# EAGLE schematic Brakeout board - wire connection (EAGLE 9.6.2)
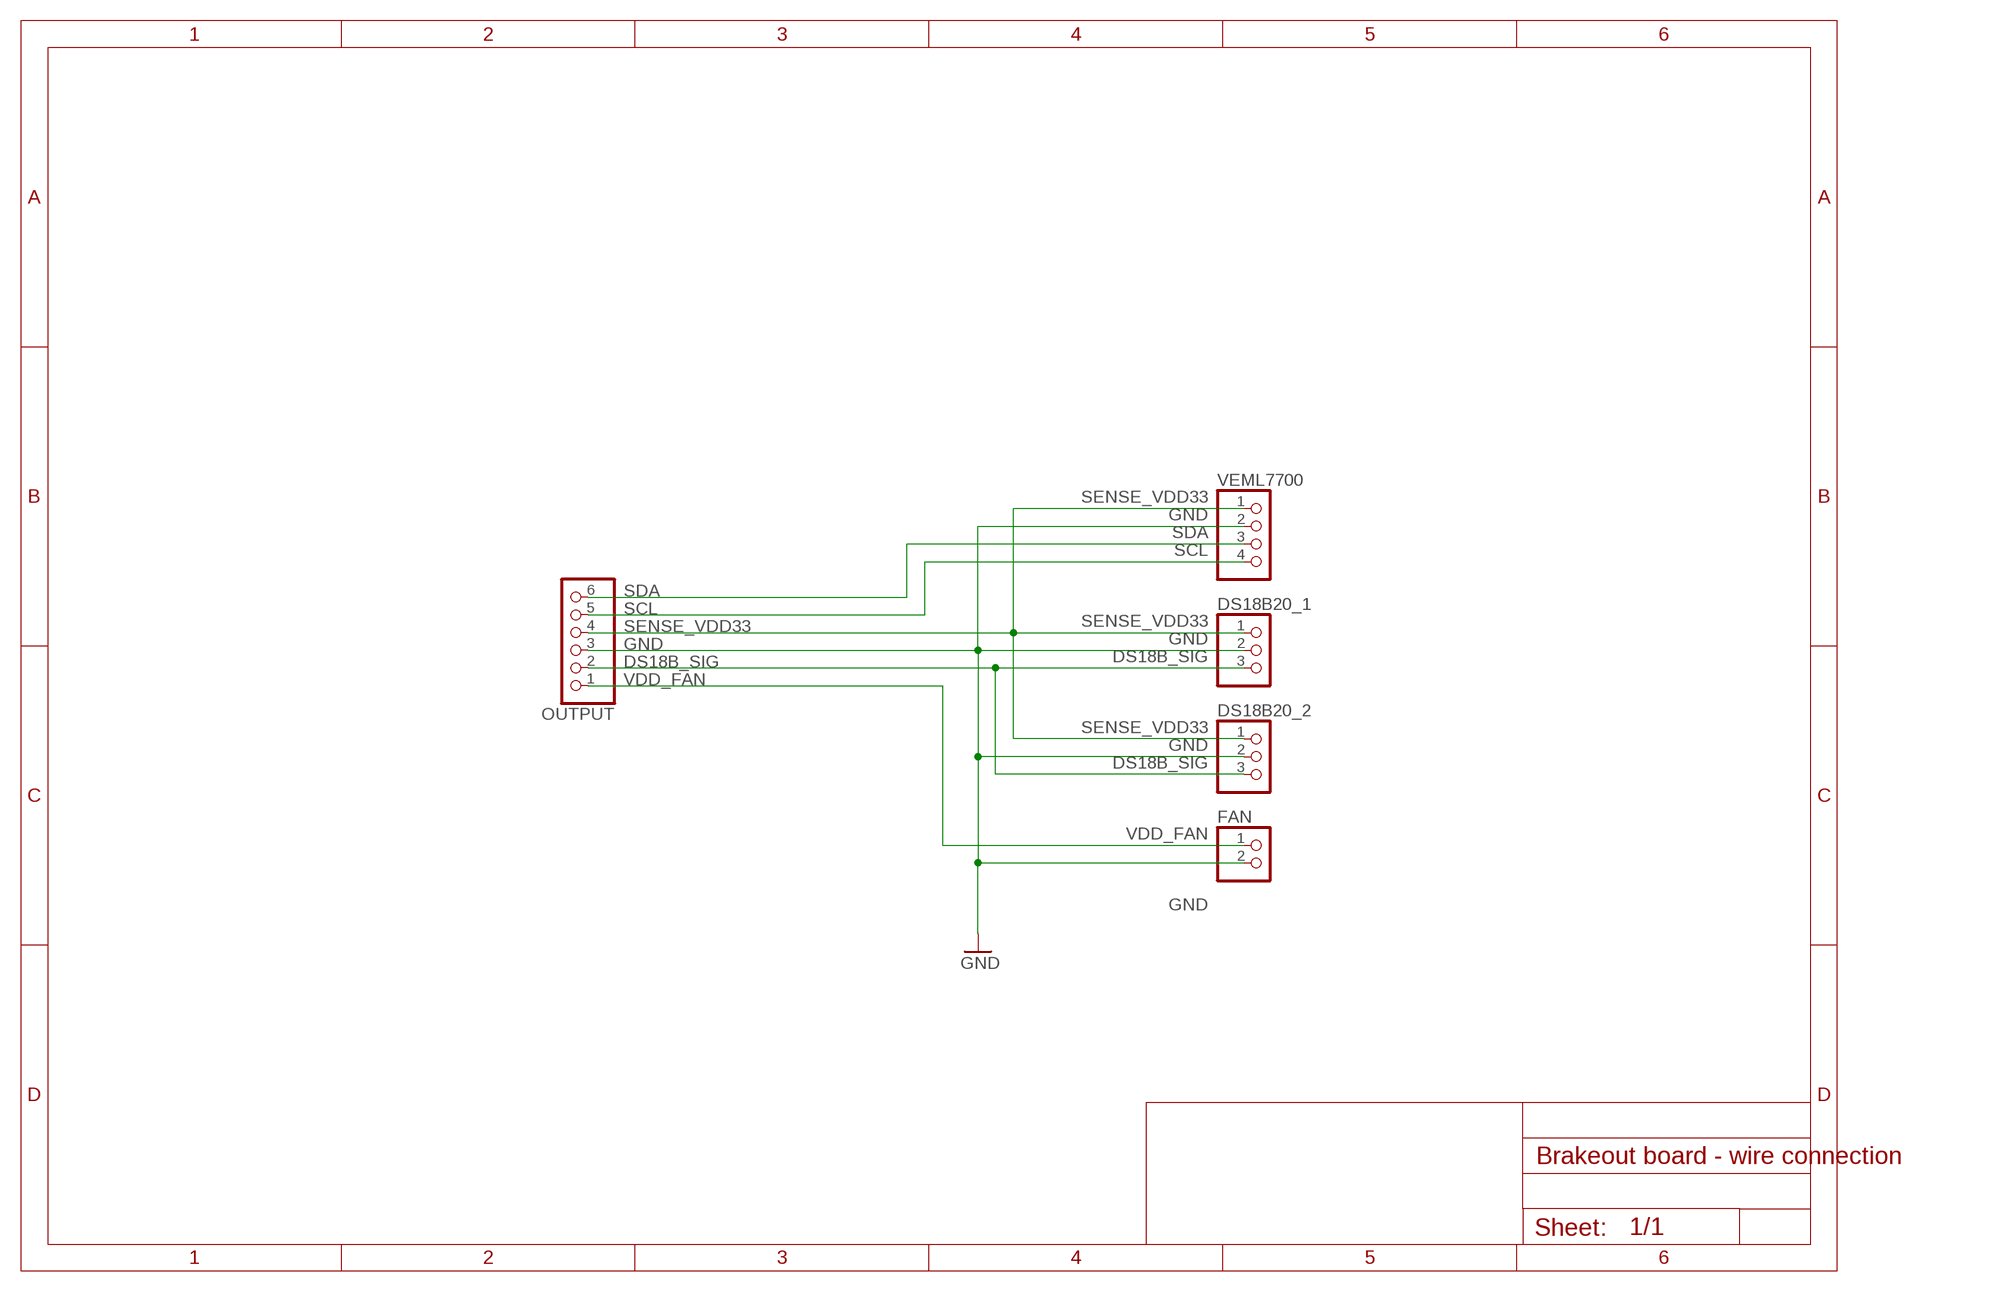
[diagram p0: schematic, sheet 1]

## Parts
DS18B20_1  PINHD-1X3  [1X03]
DS18B20_2  PINHD-1X3  [1X03]
FAN  PINHD-1X2  [1X02]
OUTPUT  PINHD-1X6  [1X06]
VEML7700  PINHD-1X4  [1X04]

## Nets
DS18B_SIG: DS18B20_1.3 DS18B20_2.3 OUTPUT.2
GND: DS18B20_1.2 DS18B20_2.2 FAN.2 OUTPUT.3 VEML7700.2
SCL: OUTPUT.5 VEML7700.4
SDA: OUTPUT.6 VEML7700.3
SENSE_VDD33: DS18B20_1.1 DS18B20_2.1 OUTPUT.4 VEML7700.1
VDD_FAN: FAN.1 OUTPUT.1

## Library data of the parts
DS18B20_1 DS18B20_2 = pinhead:PINHD-1X3: PIN HEADER
FAN = pinhead:PINHD-1X2: PIN HEADER
OUTPUT = pinhead:PINHD-1X6: PIN HEADER
VEML7700 = pinhead:PINHD-1X4: PIN HEADER